# Altium project RGB_Matrix.PrjPcb (part 2 of 2)

## Sheet RGBM-05.SchDoc
size Tabloid; SheetNumber: 5; SheetTotal: 7
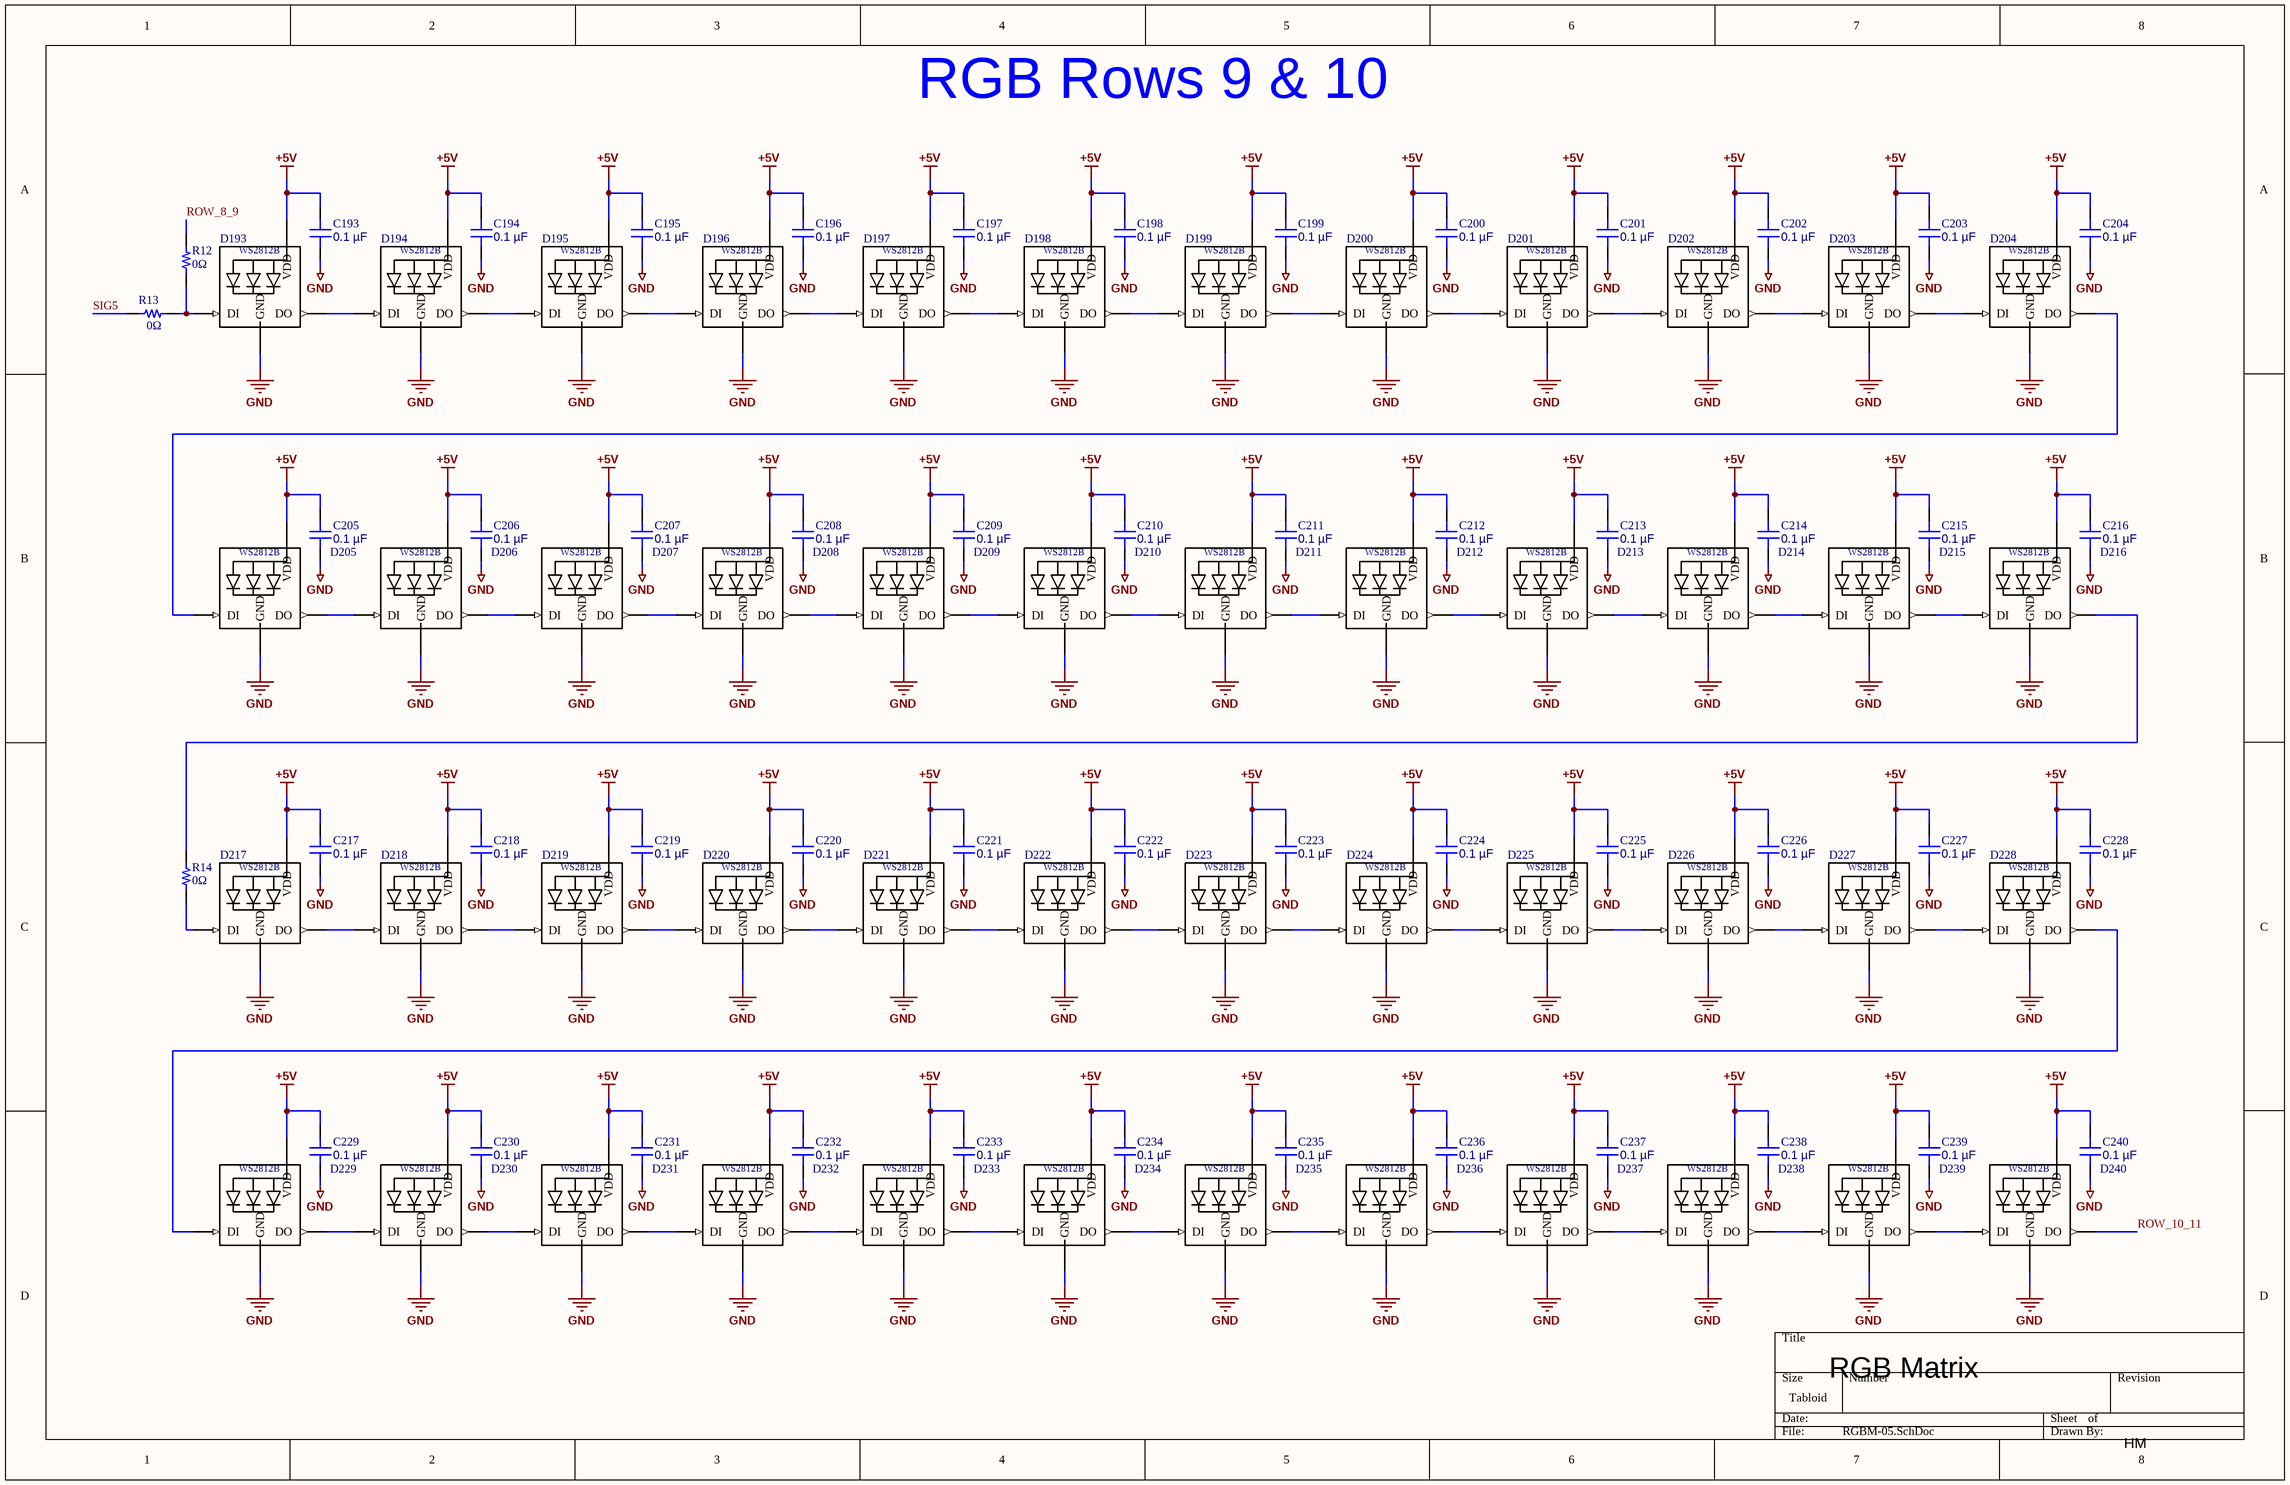
[diagram p4: RGBM-05.SchDoc]

### Parts
C193  0.1 µF  [CAP 0603_1608]
C194  0.1 µF  [CAP 0603_1608]
C195  0.1 µF  [CAP 0603_1608]
C196  0.1 µF  [CAP 0603_1608]
C197  0.1 µF  [CAP 0603_1608]
C198  0.1 µF  [CAP 0603_1608]
C199  0.1 µF  [CAP 0603_1608]
C200  0.1 µF  [CAP 0603_1608]
C201  0.1 µF  [CAP 0603_1608]
C202  0.1 µF  [CAP 0603_1608]
C203  0.1 µF  [CAP 0603_1608]
C204  0.1 µF  [CAP 0603_1608]
C205  0.1 µF  [CAP 0603_1608]
C206  0.1 µF  [CAP 0603_1608]
C207  0.1 µF  [CAP 0603_1608]
C208  0.1 µF  [CAP 0603_1608]
C209  0.1 µF  [CAP 0603_1608]
C210  0.1 µF  [CAP 0603_1608]
C211  0.1 µF  [CAP 0603_1608]
C212  0.1 µF  [CAP 0603_1608]
C213  0.1 µF  [CAP 0603_1608]
C214  0.1 µF  [CAP 0603_1608]
C215  0.1 µF  [CAP 0603_1608]
C216  0.1 µF  [CAP 0603_1608]
C217  0.1 µF  [CAP 0603_1608]
C218  0.1 µF  [CAP 0603_1608]
C219  0.1 µF  [CAP 0603_1608]
C220  0.1 µF  [CAP 0603_1608]
C221  0.1 µF  [CAP 0603_1608]
C222  0.1 µF  [CAP 0603_1608]
C223  0.1 µF  [CAP 0603_1608]
C224  0.1 µF  [CAP 0603_1608]
C225  0.1 µF  [CAP 0603_1608]
C226  0.1 µF  [CAP 0603_1608]
C227  0.1 µF  [CAP 0603_1608]
C228  0.1 µF  [CAP 0603_1608]
C229  0.1 µF  [CAP 0603_1608]
C230  0.1 µF  [CAP 0603_1608]
C231  0.1 µF  [CAP 0603_1608]
C232  0.1 µF  [CAP 0603_1608]
C233  0.1 µF  [CAP 0603_1608]
C234  0.1 µF  [CAP 0603_1608]
C235  0.1 µF  [CAP 0603_1608]
C236  0.1 µF  [CAP 0603_1608]
C237  0.1 µF  [CAP 0603_1608]
C238  0.1 µF  [CAP 0603_1608]
C239  0.1 µF  [CAP 0603_1608]
C240  0.1 µF  [CAP 0603_1608]
D193  WS2812B  [*WS2812B_WS2812B(Primary)]  (value not drawn)
D194  WS2812B  [*WS2812B_WS2812B(Primary)]  (value not drawn)
D195  WS2812B  [*WS2812B_WS2812B(Primary)]  (value not drawn)
D196  WS2812B  [*WS2812B_WS2812B(Primary)]  (value not drawn)
D197  WS2812B  [*WS2812B_WS2812B(Primary)]  (value not drawn)
D198  WS2812B  [*WS2812B_WS2812B(Primary)]  (value not drawn)
D199  WS2812B  [*WS2812B_WS2812B(Primary)]  (value not drawn)
D200  WS2812B  [*WS2812B_WS2812B(Primary)]  (value not drawn)
D201  WS2812B  [*WS2812B_WS2812B(Primary)]  (value not drawn)
D202  WS2812B  [*WS2812B_WS2812B(Primary)]  (value not drawn)
D203  WS2812B  [*WS2812B_WS2812B(Primary)]  (value not drawn)
D204  WS2812B  [*WS2812B_WS2812B(Primary)]  (value not drawn)
D205  WS2812B  [*WS2812B_WS2812B(Primary)]  (value not drawn)
D206  WS2812B  [*WS2812B_WS2812B(Primary)]  (value not drawn)
D207  WS2812B  [*WS2812B_WS2812B(Primary)]  (value not drawn)
D208  WS2812B  [*WS2812B_WS2812B(Primary)]  (value not drawn)
D209  WS2812B  [*WS2812B_WS2812B(Primary)]  (value not drawn)
D210  WS2812B  [*WS2812B_WS2812B(Primary)]  (value not drawn)
D211  WS2812B  [*WS2812B_WS2812B(Primary)]  (value not drawn)
D212  WS2812B  [*WS2812B_WS2812B(Primary)]  (value not drawn)
D213  WS2812B  [*WS2812B_WS2812B(Primary)]  (value not drawn)
D214  WS2812B  [*WS2812B_WS2812B(Primary)]  (value not drawn)
D215  WS2812B  [*WS2812B_WS2812B(Primary)]  (value not drawn)
D216  WS2812B  [*WS2812B_WS2812B(Primary)]  (value not drawn)
D217  WS2812B  [*WS2812B_WS2812B(Primary)]  (value not drawn)
D218  WS2812B  [*WS2812B_WS2812B(Primary)]  (value not drawn)
D219  WS2812B  [*WS2812B_WS2812B(Primary)]  (value not drawn)
D220  WS2812B  [*WS2812B_WS2812B(Primary)]  (value not drawn)
D221  WS2812B  [*WS2812B_WS2812B(Primary)]  (value not drawn)
D222  WS2812B  [*WS2812B_WS2812B(Primary)]  (value not drawn)
D223  WS2812B  [*WS2812B_WS2812B(Primary)]  (value not drawn)
D224  WS2812B  [*WS2812B_WS2812B(Primary)]  (value not drawn)
D225  WS2812B  [*WS2812B_WS2812B(Primary)]  (value not drawn)
D226  WS2812B  [*WS2812B_WS2812B(Primary)]  (value not drawn)
D227  WS2812B  [*WS2812B_WS2812B(Primary)]  (value not drawn)
D228  WS2812B  [*WS2812B_WS2812B(Primary)]  (value not drawn)
D229  WS2812B  [*WS2812B_WS2812B(Primary)]  (value not drawn)
D230  WS2812B  [*WS2812B_WS2812B(Primary)]  (value not drawn)
D231  WS2812B  [*WS2812B_WS2812B(Primary)]  (value not drawn)
D232  WS2812B  [*WS2812B_WS2812B(Primary)]  (value not drawn)
D233  WS2812B  [*WS2812B_WS2812B(Primary)]  (value not drawn)
D234  WS2812B  [*WS2812B_WS2812B(Primary)]  (value not drawn)
D235  WS2812B  [*WS2812B_WS2812B(Primary)]  (value not drawn)
D236  WS2812B  [*WS2812B_WS2812B(Primary)]  (value not drawn)
D237  WS2812B  [*WS2812B_WS2812B(Primary)]  (value not drawn)
D238  WS2812B  [*WS2812B_WS2812B(Primary)]  (value not drawn)
D239  WS2812B  [*WS2812B_WS2812B(Primary)]  (value not drawn)
D240  WS2812B  [*WS2812B_WS2812B(Primary)]  (value not drawn)
R12  0Ω  [RES 0603_1608]
R13  0Ω  [RES 0603_1608]
R14  0Ω  [RES 0603_1608]

### Nets
+5V: C193.2 C194.2 C195.2 C196.2 C197.2 C198.2 C199.2 C200.2 C201.2 C202.2 C203.2 C204.2 C205.2 C206.2 C207.2 C208.2 C209.2 C210.2 C211.2 C212.2 C213.2 C214.2 C215.2 C216.2 C217.2 C218.2 C219.2 C220.2 C221.2 C222.2 C223.2 C224.2 C225.2 C226.2 C227.2 C228.2 C229.2 C230.2 C231.2 C232.2 C233.2 C234.2 C235.2 C236.2 C237.2 C238.2 C239.2 C240.2 D193.1-VDD(VDD) D194.1-VDD(VDD) D195.1-VDD(VDD) D196.1-VDD(VDD) D197.1-VDD(VDD) D198.1-VDD(VDD) D199.1-VDD(VDD) D200.1-VDD(VDD) D201.1-VDD(VDD) D202.1-VDD(VDD) D203.1-VDD(VDD) D204.1-VDD(VDD) D205.1-VDD(VDD) D206.1-VDD(VDD) D207.1-VDD(VDD) D208.1-VDD(VDD) D209.1-VDD(VDD) D210.1-VDD(VDD) D211.1-VDD(VDD) D212.1-VDD(VDD) D213.1-VDD(VDD) D214.1-VDD(VDD) D215.1-VDD(VDD) D216.1-VDD(VDD) D217.1-VDD(VDD) D218.1-VDD(VDD) D219.1-VDD(VDD) D220.1-VDD(VDD) D221.1-VDD(VDD) D222.1-VDD(VDD) D223.1-VDD(VDD) D224.1-VDD(VDD) D225.1-VDD(VDD) D226.1-VDD(VDD) D227.1-VDD(VDD) D228.1-VDD(VDD) D229.1-VDD(VDD) D230.1-VDD(VDD) D231.1-VDD(VDD) D232.1-VDD(VDD) D233.1-VDD(VDD) D234.1-VDD(VDD) D235.1-VDD(VDD) D236.1-VDD(VDD) D237.1-VDD(VDD) D238.1-VDD(VDD) D239.1-VDD(VDD) D240.1-VDD(VDD)
GND: C193.1 C194.1 C195.1 C196.1 C197.1 C198.1 C199.1 C200.1 C201.1 C202.1 C203.1 C204.1 C205.1 C206.1 C207.1 C208.1 C209.1 C210.1 C211.1 C212.1 C213.1 C214.1 C215.1 C216.1 C217.1 C218.1 C219.1 C220.1 C221.1 C222.1 C223.1 C224.1 C225.1 C226.1 C227.1 C228.1 C229.1 C230.1 C231.1 C232.1 C233.1 C234.1 C235.1 C236.1 C237.1 C238.1 C239.1 C240.1 D193.3-GND(GND) D194.3-GND(GND) D195.3-GND(GND) D196.3-GND(GND) D197.3-GND(GND) D198.3-GND(GND) D199.3-GND(GND) D200.3-GND(GND) D201.3-GND(GND) D202.3-GND(GND) D203.3-GND(GND) D204.3-GND(GND) D205.3-GND(GND) D206.3-GND(GND) D207.3-GND(GND) D208.3-GND(GND) D209.3-GND(GND) D210.3-GND(GND) D211.3-GND(GND) D212.3-GND(GND) D213.3-GND(GND) D214.3-GND(GND) D215.3-GND(GND) D216.3-GND(GND) D217.3-GND(GND) D218.3-GND(GND) D219.3-GND(GND) D220.3-GND(GND) D221.3-GND(GND) D222.3-GND(GND) D223.3-GND(GND) D224.3-GND(GND) D225.3-GND(GND) D226.3-GND(GND) D227.3-GND(GND) D228.3-GND(GND) D229.3-GND(GND) D230.3-GND(GND) D231.3-GND(GND) D232.3-GND(GND) D233.3-GND(GND) D234.3-GND(GND) D235.3-GND(GND) D236.3-GND(GND) D237.3-GND(GND) D238.3-GND(GND) D239.3-GND(GND) D240.3-GND(GND)
ROW_8_9: R12.2
ROW_10_11: D240.2-DOUT(DO)
SIG5: R13.1
NetD193_2-DOUT: D193.2-DOUT(DO) D194.4-DIN(DI)
NetD193_4-DIN: D193.4-DIN(DI) R12.1 R13.2
NetD194_2-DOUT: D194.2-DOUT(DO) D195.4-DIN(DI)
NetD195_2-DOUT: D195.2-DOUT(DO) D196.4-DIN(DI)
NetD196_2-DOUT: D196.2-DOUT(DO) D197.4-DIN(DI)
NetD197_2-DOUT: D197.2-DOUT(DO) D198.4-DIN(DI)
NetD198_2-DOUT: D198.2-DOUT(DO) D199.4-DIN(DI)
NetD199_2-DOUT: D199.2-DOUT(DO) D200.4-DIN(DI)
NetD200_2-DOUT: D200.2-DOUT(DO) D201.4-DIN(DI)
NetD201_2-DOUT: D201.2-DOUT(DO) D202.4-DIN(DI)
NetD202_2-DOUT: D202.2-DOUT(DO) D203.4-DIN(DI)
NetD203_2-DOUT: D203.2-DOUT(DO) D204.4-DIN(DI)
NetD204_2-DOUT: D204.2-DOUT(DO) D205.4-DIN(DI)
NetD205_2-DOUT: D205.2-DOUT(DO) D206.4-DIN(DI)
NetD206_2-DOUT: D206.2-DOUT(DO) D207.4-DIN(DI)
NetD207_2-DOUT: D207.2-DOUT(DO) D208.4-DIN(DI)
NetD208_2-DOUT: D208.2-DOUT(DO) D209.4-DIN(DI)
NetD209_2-DOUT: D209.2-DOUT(DO) D210.4-DIN(DI)
NetD210_2-DOUT: D210.2-DOUT(DO) D211.4-DIN(DI)
NetD211_2-DOUT: D211.2-DOUT(DO) D212.4-DIN(DI)
NetD212_2-DOUT: D212.2-DOUT(DO) D213.4-DIN(DI)
NetD213_2-DOUT: D213.2-DOUT(DO) D214.4-DIN(DI)
NetD214_2-DOUT: D214.2-DOUT(DO) D215.4-DIN(DI)
NetD215_2-DOUT: D215.2-DOUT(DO) D216.4-DIN(DI)
NetD216_2-DOUT: D216.2-DOUT(DO) R14.2
NetD217_2-DOUT: D217.2-DOUT(DO) D218.4-DIN(DI)
NetD217_4-DIN: D217.4-DIN(DI) R14.1
NetD218_2-DOUT: D218.2-DOUT(DO) D219.4-DIN(DI)
NetD219_2-DOUT: D219.2-DOUT(DO) D220.4-DIN(DI)
NetD220_2-DOUT: D220.2-DOUT(DO) D221.4-DIN(DI)
NetD221_2-DOUT: D221.2-DOUT(DO) D222.4-DIN(DI)
NetD222_2-DOUT: D222.2-DOUT(DO) D223.4-DIN(DI)
NetD223_2-DOUT: D223.2-DOUT(DO) D224.4-DIN(DI)
NetD224_2-DOUT: D224.2-DOUT(DO) D225.4-DIN(DI)
NetD225_2-DOUT: D225.2-DOUT(DO) D226.4-DIN(DI)
NetD226_2-DOUT: D226.2-DOUT(DO) D227.4-DIN(DI)
NetD227_2-DOUT: D227.2-DOUT(DO) D228.4-DIN(DI)
NetD228_2-DOUT: D228.2-DOUT(DO) D229.4-DIN(DI)
NetD229_2-DOUT: D229.2-DOUT(DO) D230.4-DIN(DI)
NetD230_2-DOUT: D230.2-DOUT(DO) D231.4-DIN(DI)
NetD231_2-DOUT: D231.2-DOUT(DO) D232.4-DIN(DI)
NetD232_2-DOUT: D232.2-DOUT(DO) D233.4-DIN(DI)
NetD233_2-DOUT: D233.2-DOUT(DO) D234.4-DIN(DI)
NetD234_2-DOUT: D234.2-DOUT(DO) D235.4-DIN(DI)
NetD235_2-DOUT: D235.2-DOUT(DO) D236.4-DIN(DI)
NetD236_2-DOUT: D236.2-DOUT(DO) D237.4-DIN(DI)
NetD237_2-DOUT: D237.2-DOUT(DO) D238.4-DIN(DI)
NetD238_2-DOUT: D238.2-DOUT(DO) D239.4-DIN(DI)
NetD239_2-DOUT: D239.2-DOUT(DO) D240.4-DIN(DI)

### Notes on the sheet
- RGB Rows 9 & 10
- RGB Matrix
- HM

### Library data of the parts
C193-C240 = C0603C104K5RAC7411: as C1 on sheet RGBM-01; Part Number: C0603C104K5RAC7411; Capacitance: 0.1 µF; Applications: Bypass, Decoupling; componentlink1description: Datasheet; componentlink1url: https://api.kemet.com/component-edge/download/datasheet/C0603C104K5RAC7411.pdf; componentlink2description: DigiKey Link; componentlink2url: https://www.digikey.com/en/products/detail/kemet/C0603C104K5RAC7411/3317013; Device Package: 0603 (1608 Metric); lastupdated: 2026-04-06 7:23:52 PM; Lifecycle Status: Active; Minimum Order: 1; Mounting Type: Surface Mount, MLCC; Operating Temperature: -55°C ~ 125°C; Package / Case: 0603 (1608 Metric); packaging: TapeAndReel; partid: 2233; Part Status: Active; price: 0.01; series: SMD Comm X7R; Size / Dimension: 0.063" L x 0.031" W (1.60mm x 0.80mm); Supplier 1: DigiKey; Supplier Part Number 1: 399-C0603C104K5RAC7411CT-ND; Temperature Coefficient: X7R; Thickness (Max): 0.035" (0.90mm); value: 0.1 µF; Voltage - Rated: 50V
D193-D240 = WS2812B: as D1 on sheet RGBM-01; SnapEDA_Link: https://www.snapeda.com/parts/WS2812B/Worldsemi/view-part/?ref=snap; Package: None; MP: WS2812B; Check_prices: https://www.snapeda.com/parts/WS2812B/Worldsemi/view-part/?ref=eda; Value: *
R12-R14 = YJP1608-R001: as R1 on sheet RGBM-01; Part Number: YJP1608-R001; ComponentLink1Description: Datasheet; ComponentLink1URL: http://www.susumu.co.jp/common/pdf/n_catalog_partition10_en.pdf; ComponentLink2Description: DigiKey Link; ComponentLink2URL: https://www.digikey.com/en/products/detail/susumu/YJP1608-R001/2815047; Composition: Thin Film; Device Package: 0603 (1608 Metric); Height - Seated (Max): 0.016" (0.40mm); LastUpdated: 2024-02-09 8:42:50 PM; Lifecycle Status: Active; Minimum Order: 1; Number of Terminations: 2; Operating Temperature: -40°C ~ 125°C; Package / Case: 0603 (1608 Metric); Packaging: TapeAndReel; PartId: 16802; Part Status: Active; Price: 0.08; Resistance: 0 Ohms; Series: YJP; Size / Dimension: 0.063" L x 0.031" W (1.60mm x 0.80mm); Supplier 1: DigiKey; Supplier Part Number 1: 408-1515-1-ND; Supplier Device Package: 0603; Tolerance: Jumper

## Sheet RGBM-06.SchDoc
size Tabloid; SheetNumber: 6; SheetTotal: 7
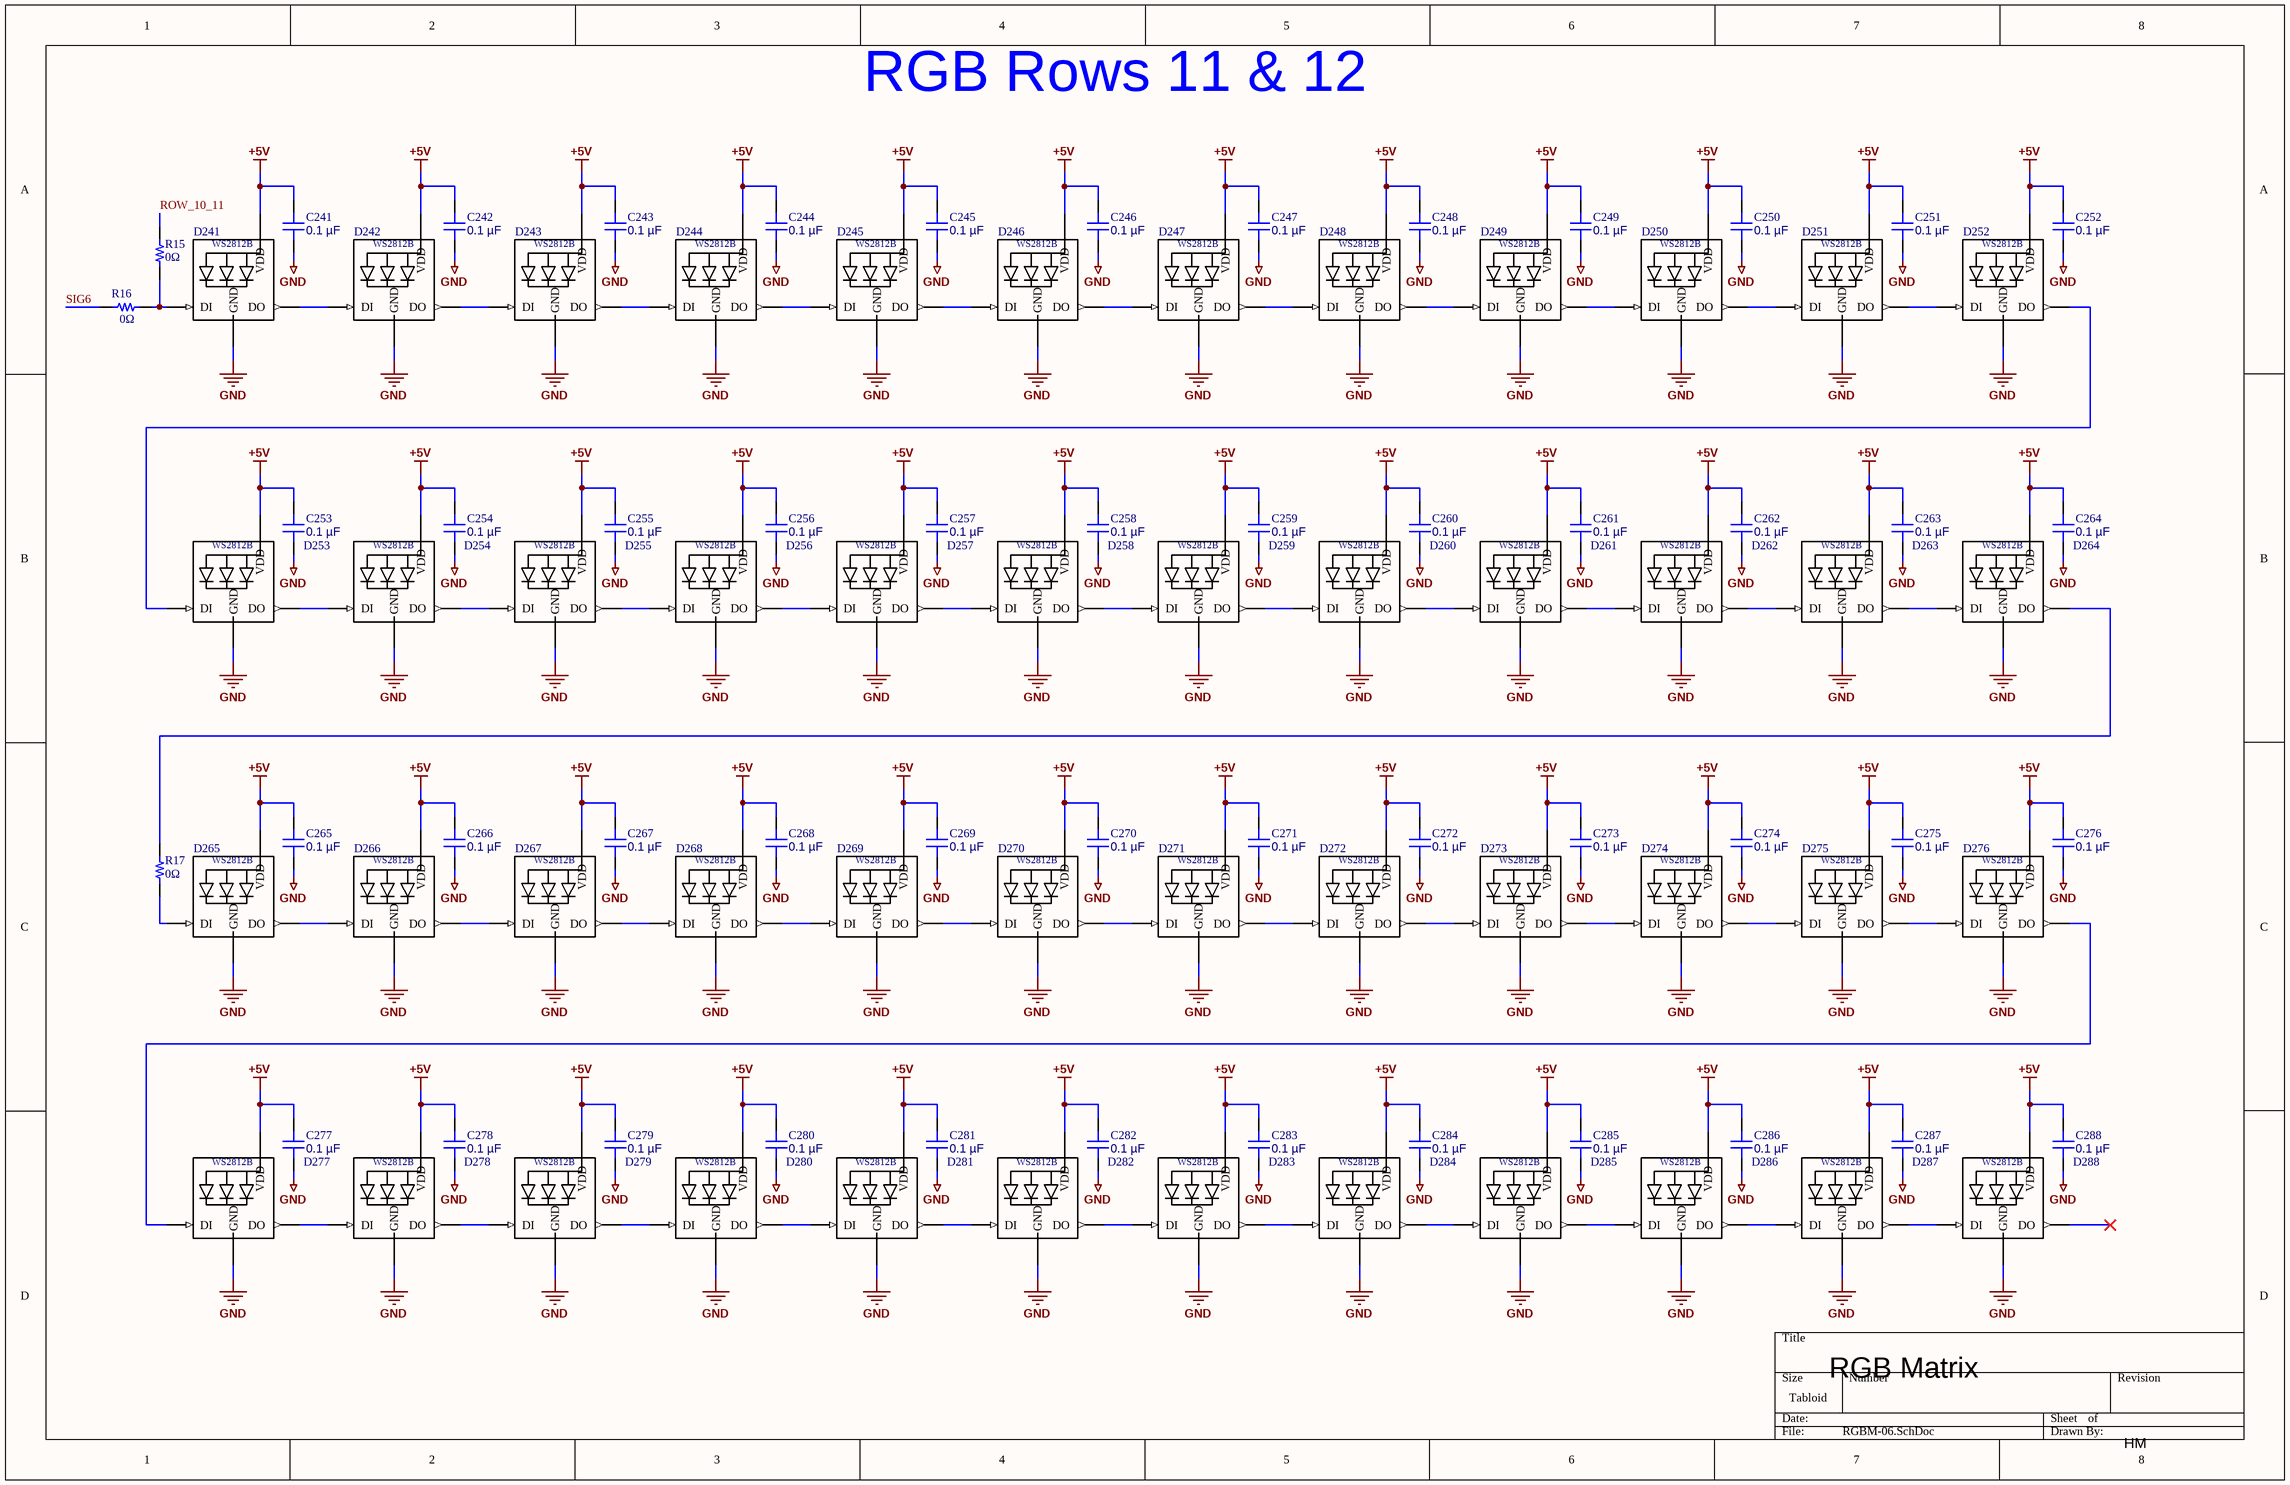
[diagram p5: RGBM-06.SchDoc]

### Parts
C241  0.1 µF  [CAP 0603_1608]
C242  0.1 µF  [CAP 0603_1608]
C243  0.1 µF  [CAP 0603_1608]
C244  0.1 µF  [CAP 0603_1608]
C245  0.1 µF  [CAP 0603_1608]
C246  0.1 µF  [CAP 0603_1608]
C247  0.1 µF  [CAP 0603_1608]
C248  0.1 µF  [CAP 0603_1608]
C249  0.1 µF  [CAP 0603_1608]
C250  0.1 µF  [CAP 0603_1608]
C251  0.1 µF  [CAP 0603_1608]
C252  0.1 µF  [CAP 0603_1608]
C253  0.1 µF  [CAP 0603_1608]
C254  0.1 µF  [CAP 0603_1608]
C255  0.1 µF  [CAP 0603_1608]
C256  0.1 µF  [CAP 0603_1608]
C257  0.1 µF  [CAP 0603_1608]
C258  0.1 µF  [CAP 0603_1608]
C259  0.1 µF  [CAP 0603_1608]
C260  0.1 µF  [CAP 0603_1608]
C261  0.1 µF  [CAP 0603_1608]
C262  0.1 µF  [CAP 0603_1608]
C263  0.1 µF  [CAP 0603_1608]
C264  0.1 µF  [CAP 0603_1608]
C265  0.1 µF  [CAP 0603_1608]
C266  0.1 µF  [CAP 0603_1608]
C267  0.1 µF  [CAP 0603_1608]
C268  0.1 µF  [CAP 0603_1608]
C269  0.1 µF  [CAP 0603_1608]
C270  0.1 µF  [CAP 0603_1608]
C271  0.1 µF  [CAP 0603_1608]
C272  0.1 µF  [CAP 0603_1608]
C273  0.1 µF  [CAP 0603_1608]
C274  0.1 µF  [CAP 0603_1608]
C275  0.1 µF  [CAP 0603_1608]
C276  0.1 µF  [CAP 0603_1608]
C277  0.1 µF  [CAP 0603_1608]
C278  0.1 µF  [CAP 0603_1608]
C279  0.1 µF  [CAP 0603_1608]
C280  0.1 µF  [CAP 0603_1608]
C281  0.1 µF  [CAP 0603_1608]
C282  0.1 µF  [CAP 0603_1608]
C283  0.1 µF  [CAP 0603_1608]
C284  0.1 µF  [CAP 0603_1608]
C285  0.1 µF  [CAP 0603_1608]
C286  0.1 µF  [CAP 0603_1608]
C287  0.1 µF  [CAP 0603_1608]
C288  0.1 µF  [CAP 0603_1608]
D241  WS2812B  [*WS2812B_WS2812B(Primary)]  (value not drawn)
D242  WS2812B  [*WS2812B_WS2812B(Primary)]  (value not drawn)
D243  WS2812B  [*WS2812B_WS2812B(Primary)]  (value not drawn)
D244  WS2812B  [*WS2812B_WS2812B(Primary)]  (value not drawn)
D245  WS2812B  [*WS2812B_WS2812B(Primary)]  (value not drawn)
D246  WS2812B  [*WS2812B_WS2812B(Primary)]  (value not drawn)
D247  WS2812B  [*WS2812B_WS2812B(Primary)]  (value not drawn)
D248  WS2812B  [*WS2812B_WS2812B(Primary)]  (value not drawn)
D249  WS2812B  [*WS2812B_WS2812B(Primary)]  (value not drawn)
D250  WS2812B  [*WS2812B_WS2812B(Primary)]  (value not drawn)
D251  WS2812B  [*WS2812B_WS2812B(Primary)]  (value not drawn)
D252  WS2812B  [*WS2812B_WS2812B(Primary)]  (value not drawn)
D253  WS2812B  [*WS2812B_WS2812B(Primary)]  (value not drawn)
D254  WS2812B  [*WS2812B_WS2812B(Primary)]  (value not drawn)
D255  WS2812B  [*WS2812B_WS2812B(Primary)]  (value not drawn)
D256  WS2812B  [*WS2812B_WS2812B(Primary)]  (value not drawn)
D257  WS2812B  [*WS2812B_WS2812B(Primary)]  (value not drawn)
D258  WS2812B  [*WS2812B_WS2812B(Primary)]  (value not drawn)
D259  WS2812B  [*WS2812B_WS2812B(Primary)]  (value not drawn)
D260  WS2812B  [*WS2812B_WS2812B(Primary)]  (value not drawn)
D261  WS2812B  [*WS2812B_WS2812B(Primary)]  (value not drawn)
D262  WS2812B  [*WS2812B_WS2812B(Primary)]  (value not drawn)
D263  WS2812B  [*WS2812B_WS2812B(Primary)]  (value not drawn)
D264  WS2812B  [*WS2812B_WS2812B(Primary)]  (value not drawn)
D265  WS2812B  [*WS2812B_WS2812B(Primary)]  (value not drawn)
D266  WS2812B  [*WS2812B_WS2812B(Primary)]  (value not drawn)
D267  WS2812B  [*WS2812B_WS2812B(Primary)]  (value not drawn)
D268  WS2812B  [*WS2812B_WS2812B(Primary)]  (value not drawn)
D269  WS2812B  [*WS2812B_WS2812B(Primary)]  (value not drawn)
D270  WS2812B  [*WS2812B_WS2812B(Primary)]  (value not drawn)
D271  WS2812B  [*WS2812B_WS2812B(Primary)]  (value not drawn)
D272  WS2812B  [*WS2812B_WS2812B(Primary)]  (value not drawn)
D273  WS2812B  [*WS2812B_WS2812B(Primary)]  (value not drawn)
D274  WS2812B  [*WS2812B_WS2812B(Primary)]  (value not drawn)
D275  WS2812B  [*WS2812B_WS2812B(Primary)]  (value not drawn)
D276  WS2812B  [*WS2812B_WS2812B(Primary)]  (value not drawn)
D277  WS2812B  [*WS2812B_WS2812B(Primary)]  (value not drawn)
D278  WS2812B  [*WS2812B_WS2812B(Primary)]  (value not drawn)
D279  WS2812B  [*WS2812B_WS2812B(Primary)]  (value not drawn)
D280  WS2812B  [*WS2812B_WS2812B(Primary)]  (value not drawn)
D281  WS2812B  [*WS2812B_WS2812B(Primary)]  (value not drawn)
D282  WS2812B  [*WS2812B_WS2812B(Primary)]  (value not drawn)
D283  WS2812B  [*WS2812B_WS2812B(Primary)]  (value not drawn)
D284  WS2812B  [*WS2812B_WS2812B(Primary)]  (value not drawn)
D285  WS2812B  [*WS2812B_WS2812B(Primary)]  (value not drawn)
D286  WS2812B  [*WS2812B_WS2812B(Primary)]  (value not drawn)
D287  WS2812B  [*WS2812B_WS2812B(Primary)]  (value not drawn)
D288  WS2812B  [*WS2812B_WS2812B(Primary)]  (value not drawn)
R15  0Ω  [RES 0603_1608]
R16  0Ω  [RES 0603_1608]
R17  0Ω  [RES 0603_1608]

### Nets
+5V: C241.2 C242.2 C243.2 C244.2 C245.2 C246.2 C247.2 C248.2 C249.2 C250.2 C251.2 C252.2 C253.2 C254.2 C255.2 C256.2 C257.2 C258.2 C259.2 C260.2 C261.2 C262.2 C263.2 C264.2 C265.2 C266.2 C267.2 C268.2 C269.2 C270.2 C271.2 C272.2 C273.2 C274.2 C275.2 C276.2 C277.2 C278.2 C279.2 C280.2 C281.2 C282.2 C283.2 C284.2 C285.2 C286.2 C287.2 C288.2 D241.1-VDD(VDD) D242.1-VDD(VDD) D243.1-VDD(VDD) D244.1-VDD(VDD) D245.1-VDD(VDD) D246.1-VDD(VDD) D247.1-VDD(VDD) D248.1-VDD(VDD) D249.1-VDD(VDD) D250.1-VDD(VDD) D251.1-VDD(VDD) D252.1-VDD(VDD) D253.1-VDD(VDD) D254.1-VDD(VDD) D255.1-VDD(VDD) D256.1-VDD(VDD) D257.1-VDD(VDD) D258.1-VDD(VDD) D259.1-VDD(VDD) D260.1-VDD(VDD) D261.1-VDD(VDD) D262.1-VDD(VDD) D263.1-VDD(VDD) D264.1-VDD(VDD) D265.1-VDD(VDD) D266.1-VDD(VDD) D267.1-VDD(VDD) D268.1-VDD(VDD) D269.1-VDD(VDD) D270.1-VDD(VDD) D271.1-VDD(VDD) D272.1-VDD(VDD) D273.1-VDD(VDD) D274.1-VDD(VDD) D275.1-VDD(VDD) D276.1-VDD(VDD) D277.1-VDD(VDD) D278.1-VDD(VDD) D279.1-VDD(VDD) D280.1-VDD(VDD) D281.1-VDD(VDD) D282.1-VDD(VDD) D283.1-VDD(VDD) D284.1-VDD(VDD) D285.1-VDD(VDD) D286.1-VDD(VDD) D287.1-VDD(VDD) D288.1-VDD(VDD)
GND: C241.1 C242.1 C243.1 C244.1 C245.1 C246.1 C247.1 C248.1 C249.1 C250.1 C251.1 C252.1 C253.1 C254.1 C255.1 C256.1 C257.1 C258.1 C259.1 C260.1 C261.1 C262.1 C263.1 C264.1 C265.1 C266.1 C267.1 C268.1 C269.1 C270.1 C271.1 C272.1 C273.1 C274.1 C275.1 C276.1 C277.1 C278.1 C279.1 C280.1 C281.1 C282.1 C283.1 C284.1 C285.1 C286.1 C287.1 C288.1 D241.3-GND(GND) D242.3-GND(GND) D243.3-GND(GND) D244.3-GND(GND) D245.3-GND(GND) D246.3-GND(GND) D247.3-GND(GND) D248.3-GND(GND) D249.3-GND(GND) D250.3-GND(GND) D251.3-GND(GND) D252.3-GND(GND) D253.3-GND(GND) D254.3-GND(GND) D255.3-GND(GND) D256.3-GND(GND) D257.3-GND(GND) D258.3-GND(GND) D259.3-GND(GND) D260.3-GND(GND) D261.3-GND(GND) D262.3-GND(GND) D263.3-GND(GND) D264.3-GND(GND) D265.3-GND(GND) D266.3-GND(GND) D267.3-GND(GND) D268.3-GND(GND) D269.3-GND(GND) D270.3-GND(GND) D271.3-GND(GND) D272.3-GND(GND) D273.3-GND(GND) D274.3-GND(GND) D275.3-GND(GND) D276.3-GND(GND) D277.3-GND(GND) D278.3-GND(GND) D279.3-GND(GND) D280.3-GND(GND) D281.3-GND(GND) D282.3-GND(GND) D283.3-GND(GND) D284.3-GND(GND) D285.3-GND(GND) D286.3-GND(GND) D287.3-GND(GND) D288.3-GND(GND)
ROW_10_11: R15.2
SIG6: R16.1
NetD241_2-DOUT: D241.2-DOUT(DO) D242.4-DIN(DI)
NetD241_4-DIN: D241.4-DIN(DI) R15.1 R16.2
NetD242_2-DOUT: D242.2-DOUT(DO) D243.4-DIN(DI)
NetD243_2-DOUT: D243.2-DOUT(DO) D244.4-DIN(DI)
NetD244_2-DOUT: D244.2-DOUT(DO) D245.4-DIN(DI)
NetD245_2-DOUT: D245.2-DOUT(DO) D246.4-DIN(DI)
NetD246_2-DOUT: D246.2-DOUT(DO) D247.4-DIN(DI)
NetD247_2-DOUT: D247.2-DOUT(DO) D248.4-DIN(DI)
NetD248_2-DOUT: D248.2-DOUT(DO) D249.4-DIN(DI)
NetD249_2-DOUT: D249.2-DOUT(DO) D250.4-DIN(DI)
NetD250_2-DOUT: D250.2-DOUT(DO) D251.4-DIN(DI)
NetD251_2-DOUT: D251.2-DOUT(DO) D252.4-DIN(DI)
NetD252_2-DOUT: D252.2-DOUT(DO) D253.4-DIN(DI)
NetD253_2-DOUT: D253.2-DOUT(DO) D254.4-DIN(DI)
NetD254_2-DOUT: D254.2-DOUT(DO) D255.4-DIN(DI)
NetD255_2-DOUT: D255.2-DOUT(DO) D256.4-DIN(DI)
NetD256_2-DOUT: D256.2-DOUT(DO) D257.4-DIN(DI)
NetD257_2-DOUT: D257.2-DOUT(DO) D258.4-DIN(DI)
NetD258_2-DOUT: D258.2-DOUT(DO) D259.4-DIN(DI)
NetD259_2-DOUT: D259.2-DOUT(DO) D260.4-DIN(DI)
NetD260_2-DOUT: D260.2-DOUT(DO) D261.4-DIN(DI)
NetD261_2-DOUT: D261.2-DOUT(DO) D262.4-DIN(DI)
NetD262_2-DOUT: D262.2-DOUT(DO) D263.4-DIN(DI)
NetD263_2-DOUT: D263.2-DOUT(DO) D264.4-DIN(DI)
NetD264_2-DOUT: D264.2-DOUT(DO) R17.2
NetD265_2-DOUT: D265.2-DOUT(DO) D266.4-DIN(DI)
NetD265_4-DIN: D265.4-DIN(DI) R17.1
NetD266_2-DOUT: D266.2-DOUT(DO) D267.4-DIN(DI)
NetD267_2-DOUT: D267.2-DOUT(DO) D268.4-DIN(DI)
NetD268_2-DOUT: D268.2-DOUT(DO) D269.4-DIN(DI)
NetD269_2-DOUT: D269.2-DOUT(DO) D270.4-DIN(DI)
NetD270_2-DOUT: D270.2-DOUT(DO) D271.4-DIN(DI)
NetD271_2-DOUT: D271.2-DOUT(DO) D272.4-DIN(DI)
NetD272_2-DOUT: D272.2-DOUT(DO) D273.4-DIN(DI)
NetD273_2-DOUT: D273.2-DOUT(DO) D274.4-DIN(DI)
NetD274_2-DOUT: D274.2-DOUT(DO) D275.4-DIN(DI)
NetD275_2-DOUT: D275.2-DOUT(DO) D276.4-DIN(DI)
NetD276_2-DOUT: D276.2-DOUT(DO) D277.4-DIN(DI)
NetD277_2-DOUT: D277.2-DOUT(DO) D278.4-DIN(DI)
NetD278_2-DOUT: D278.2-DOUT(DO) D279.4-DIN(DI)
NetD279_2-DOUT: D279.2-DOUT(DO) D280.4-DIN(DI)
NetD280_2-DOUT: D280.2-DOUT(DO) D281.4-DIN(DI)
NetD281_2-DOUT: D281.2-DOUT(DO) D282.4-DIN(DI)
NetD282_2-DOUT: D282.2-DOUT(DO) D283.4-DIN(DI)
NetD283_2-DOUT: D283.2-DOUT(DO) D284.4-DIN(DI)
NetD284_2-DOUT: D284.2-DOUT(DO) D285.4-DIN(DI)
NetD285_2-DOUT: D285.2-DOUT(DO) D286.4-DIN(DI)
NetD286_2-DOUT: D286.2-DOUT(DO) D287.4-DIN(DI)
NetD287_2-DOUT: D287.2-DOUT(DO) D288.4-DIN(DI)

Not connected (* = marked no-connect by the designer): D288 2-DOUT(DO)*

### Notes on the sheet
- RGB Rows 11 & 12
- RGB Matrix
- HM

### Library data of the parts
C241-C288 = C0603C104K5RAC7411: CAP CER 0.1UF 50V X7R 0603; manufacturer: KEMET; Tolerance: ±10%; Part Number: C0603C104K5RAC7411; Capacitance: 0.1 µF; Applications: Bypass, Decoupling; componentlink1description: Datasheet; componentlink1url: https://api.kemet.com/component-edge/download/datasheet/C0603C104K5RAC7411.pdf; componentlink2description: DigiKey Link; componentlink2url: https://www.digikey.com/en/products/detail/kemet/C0603C104K5RAC7411/3317013; Device Package: 0603 (1608 Metric); lastupdated: 2026-04-06 7:23:52 PM; Lifecycle Status: Active; Minimum Order: 1; Mounting Type: Surface Mount, MLCC; Operating Temperature: -55°C ~ 125°C; Package / Case: 0603 (1608 Metric); packaging: TapeAndReel; partid: 2233; Part Status: Active; price: 0.01; series: SMD Comm X7R; Size / Dimension: 0.063" L x 0.031" W (1.60mm x 0.80mm); Supplier 1: DigiKey; Supplier Part Number 1: 399-C0603C104K5RAC7411CT-ND; Temperature Coefficient: X7R; Thickness (Max): 0.035" (0.90mm); value: 0.1 µF; Voltage - Rated: 50V
D241-D288 = WS2812B: Intelligent control LED integrated light source; MF: Worldsemi; SnapEDA_Link: https://www.snapeda.com/parts/WS2812B/Worldsemi/view-part/?ref=snap; Package: None; MP: WS2812B; Check_prices: https://www.snapeda.com/parts/WS2812B/Worldsemi/view-part/?ref=eda; Value: *
R15-R17 = YJP1608-R001: RES SMD 0 OHM JUMPER 0603; Manufacturer: Susumu; Value: 0 Ohms; Part Number: YJP1608-R001; ComponentLink1Description: Datasheet; ComponentLink1URL: http://www.susumu.co.jp/common/pdf/n_catalog_partition10_en.pdf; ComponentLink2Description: DigiKey Link; ComponentLink2URL: https://www.digikey.com/en/products/detail/susumu/YJP1608-R001/2815047; Composition: Thin Film; Device Package: 0603 (1608 Metric); Height - Seated (Max): 0.016" (0.40mm); LastUpdated: 2024-02-09 8:42:50 PM; Lifecycle Status: Active; Minimum Order: 1; Number of Terminations: 2; Operating Temperature: -40°C ~ 125°C; Package / Case: 0603 (1608 Metric); Packaging: TapeAndReel; PartId: 16802; Part Status: Active; Price: 0.08; Resistance: 0 Ohms; Series: YJP; Size / Dimension: 0.063" L x 0.031" W (1.60mm x 0.80mm); Supplier 1: DigiKey; Supplier Part Number 1: 408-1515-1-ND; Supplier Device Package: 0603; Tolerance: Jumper

## Sheet RGBM-07.SchDoc
size Tabloid; SheetNumber: 7; SheetTotal: 7
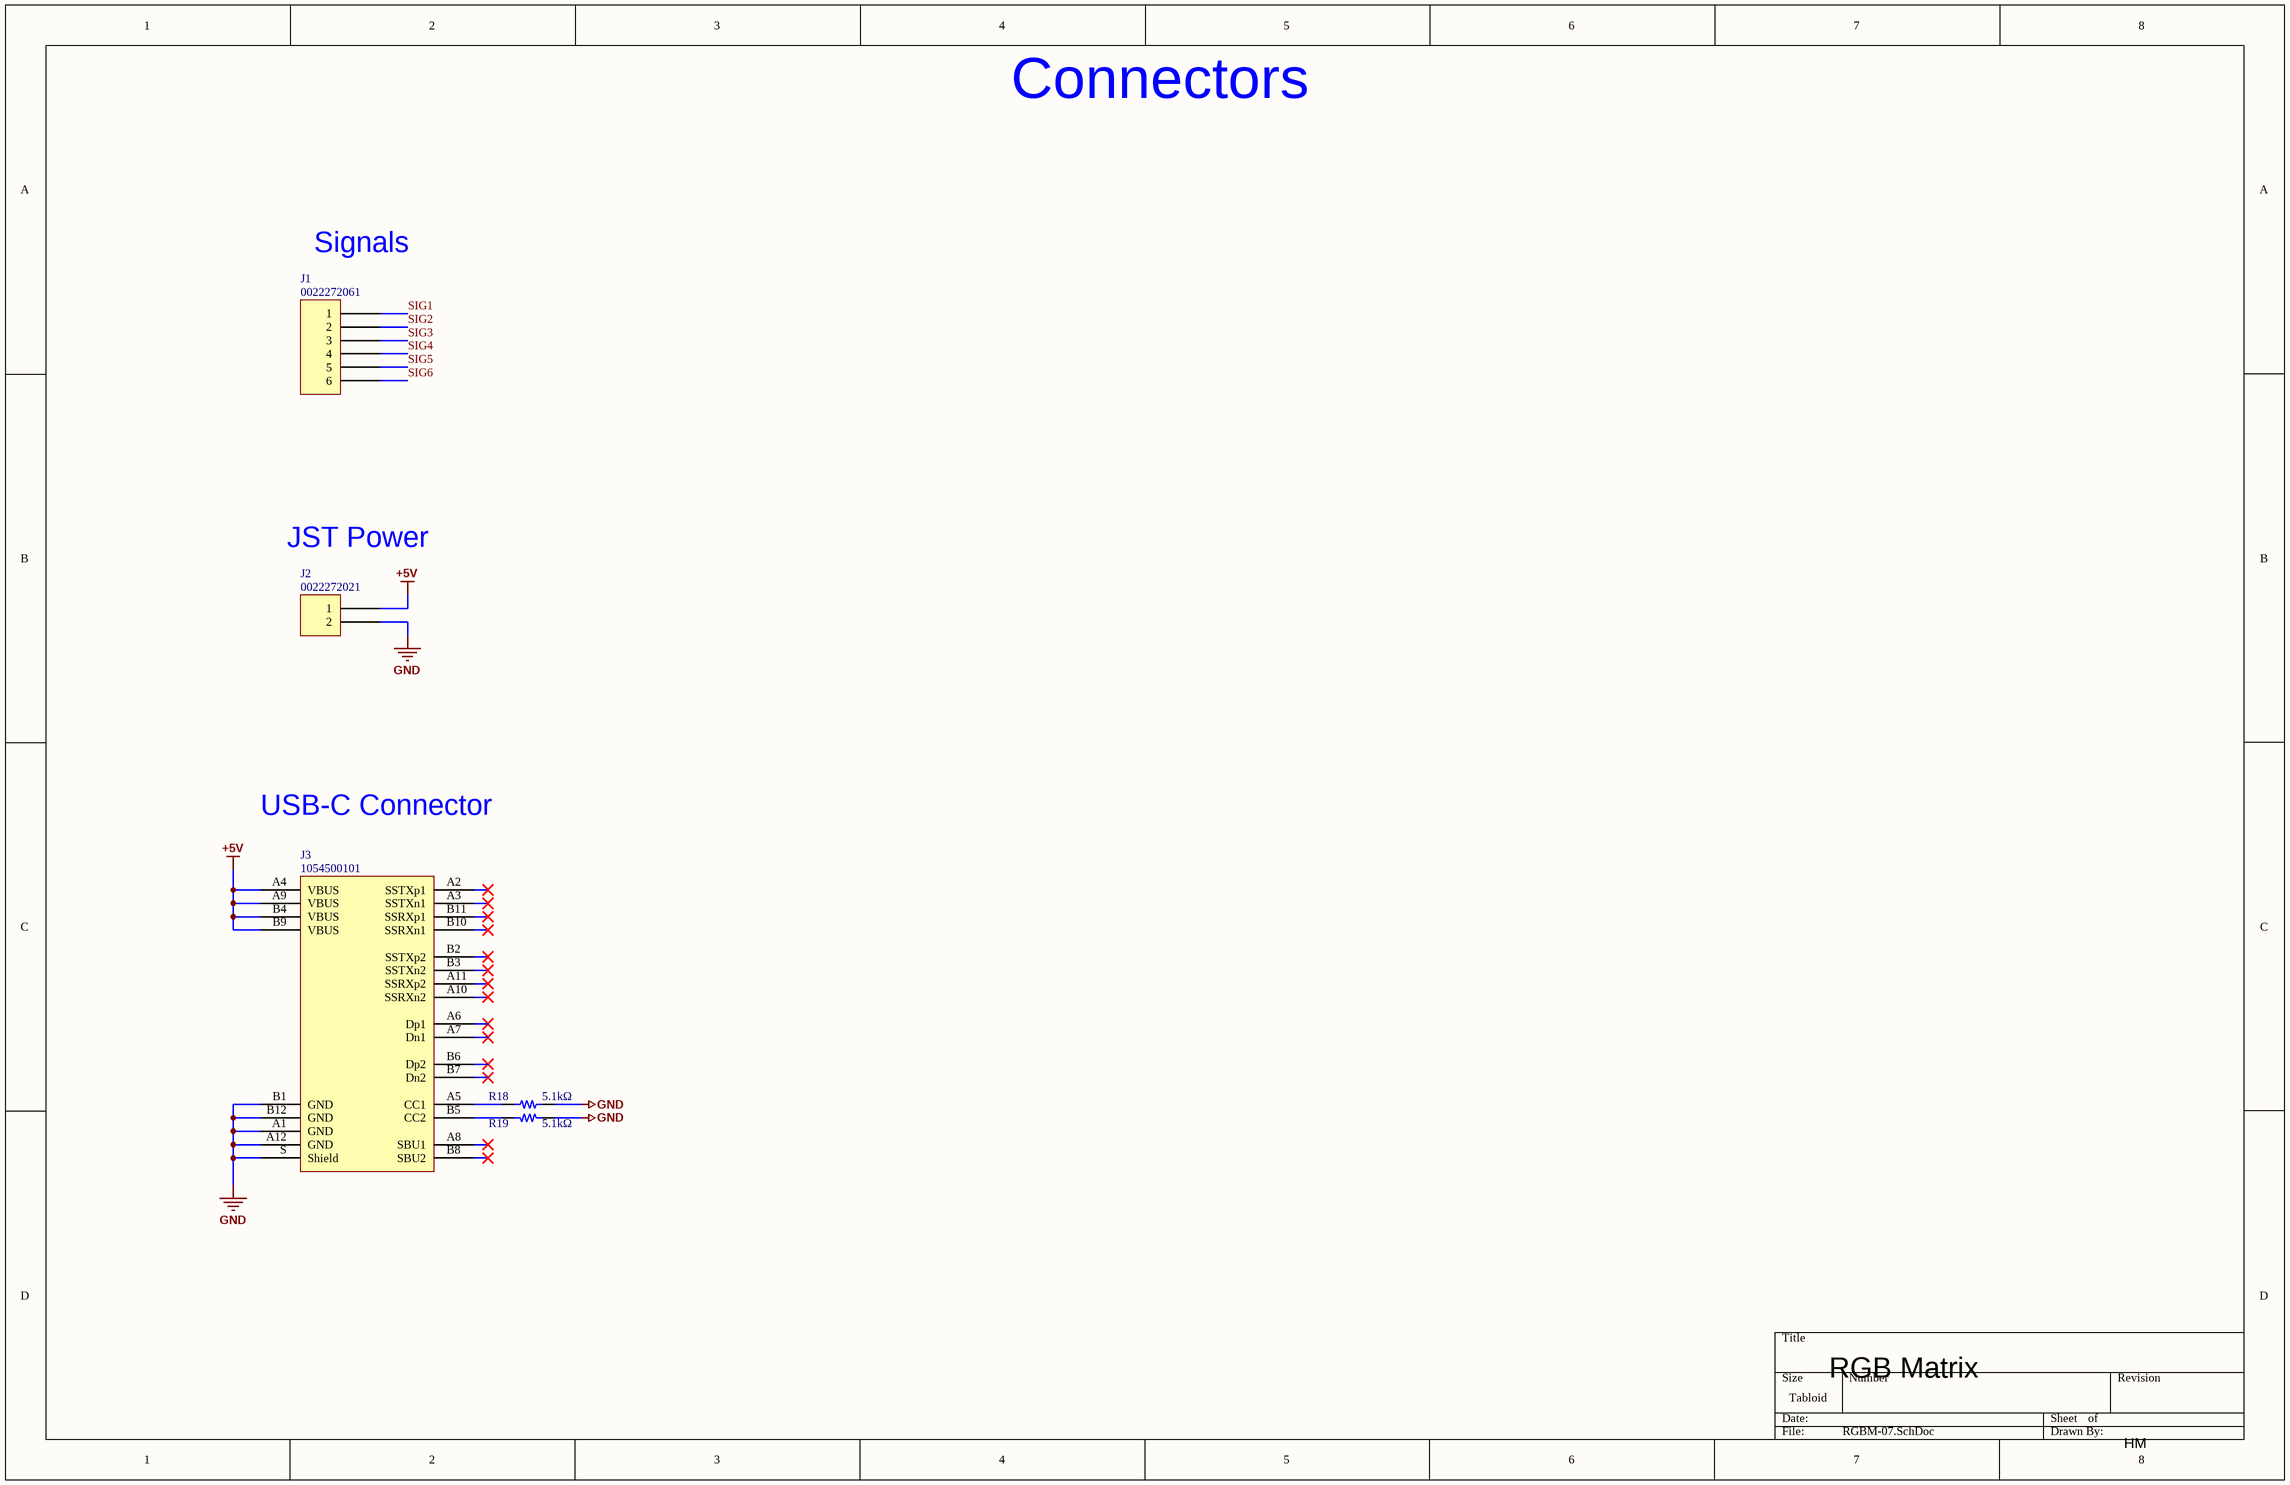
[diagram p6: RGBM-07.SchDoc]

### Parts
J1  0022272061  [MOLEX KK 0022272061]
J2  0022272021  [MOLEX KK 0022272021]
J3  1054500101  [Molex 1054500101]
R18  5.1kΩ  [RES 0603_1608]
R19  5.1kΩ  [RES 0603_1608]

### Nets
+5V: J2.1 J3.A4(VBUS) J3.A9(VBUS) J3.B4(VBUS) J3.B9(VBUS)
GND: J2.2 J3.A1(GND) J3.A12(GND) J3.B1(GND) J3.B12(GND) J3.S(Shield) R18.2 R19.2
SIG1: J1.1
SIG2: J1.2
SIG3: J1.3
SIG4: J1.4
SIG5: J1.5
SIG6: J1.6
NetJ3_A5: J3.A5(CC1) R18.1
NetJ3_B5: J3.B5(CC2) R19.1

Not connected (* = marked no-connect by the designer): J3 A2(SSTXp1)* A3(SSTXn1)* A6(Dp1)* A7(Dn1)* A8(SBU1)* A10(SSRXn2)* A11(SSRXp2)* B2(SSTXp2)* B3(SSTXn2)* B6(Dp2)* B7(Dn2)* B8(SBU2)* B10(SSRXn1)* B11(SSRXp1)*

### Notes on the sheet
- Connectors
- Signals
- JST Power
- USB-C Connector
- RGB Matrix
- HM

### Library data of the parts
J1 = 0022272061: CONN HEADER VERT 6POS 2.54MM; Manufacturer: Molex; Contact Length - Mating: 0.295" (7.49mm); Contact Length - Post: 0.140" (3.56mm); Material Flammability Rating: UL94 V-0; Number of Positions: 6; Number of Positions Loaded: All; Overall Contact Length: 0.560" (14.22mm); Pitch - Mating: 0.100" (2.54mm); Shrouding: Shrouded - 1 Wall; Style: Board to Cable/Wire; Part Number: 0022272061; ComponentLink1Description: Datasheet; ComponentLink1URL: https://www.molex.com/pdm_docs/sd/022272061_sd.pdf; ComponentLink2Description: DigiKey Link; ComponentLink2URL: http://digikey.com/product-detail/en/molex/0022272061/WM4115-ND/1130581; Connector Type: Header; Contact Finish - Mating: Tin; Contact Finish - Post: Tin; Contact Finish Thickness - Mating: 100.0µin (2.54µm); Contact Material: Brass; Contact Shape: Square; Contact Type: Male Pin; Fastening Type: Friction Lock; Insulation Color: Natural; Insulation Height: 0.461" (11.70mm); Insulation Material: Polyamide (PA), Nylon; LastUpdated: 2020-01-12 11:52:24 PM; Lifecycle Status: Active; Minimum Order: 1; Mounting Type: Through Hole; Number of Rows: 1; Packaging: Bulk; PartId: 80; Part Status: Active; Price: 0.49; Series: KK 6410; Supplier 1: DigiKey; Supplier Part Number 1: WM4115-ND; Termination: Solder
J2 = 0022272021: CONN HEADER VERT 2POS 2.54MM; Manufacturer: Molex; Contact Length - Mating: 0.295" (7.49mm); Contact Length - Post: 0.140" (3.56mm); Material Flammability Rating: UL94 V-0; Number of Positions: 2; Number of Positions Loaded: All; Overall Contact Length: 0.560" (14.22mm); Pitch - Mating: 0.100" (2.54mm); Shrouding: Shrouded - 1 Wall; Style: Board to Cable/Wire; Part Number: 0022272021; ComponentLink1Description: Datasheet; ComponentLink1URL: https://www.molex.com/pdm_docs/sd/022272021_sd.pdf; ComponentLink2Description: DigiKey Link; ComponentLink2URL: http://digikey.com/product-detail/en/molex/0022272021/WM4111-ND/1130577; Connector Type: Header; Contact Finish - Mating: Tin; Contact Finish - Post: Tin; Contact Finish Thickness - Mating: 100.0µin (2.54µm); Contact Material: Brass; Contact Shape: Square; Contact Type: Male Pin; Fastening Type: Friction Lock; Insulation Color: Natural; Insulation Height: 0.461" (11.70mm); Insulation Material: Polyamide (PA), Nylon; LastUpdated: 2020-01-12 11:51:43 PM; Lifecycle Status: Active; Minimum Order: 1; Mounting Type: Through Hole; Number of Rows: 1; Packaging: Bulk; PartId: 76; Part Status: Active; Price: 0.27; Series: KK 6410; Supplier 1: DigiKey; Supplier Part Number 1: WM4111-ND; Termination: Solder
J3 = 1054500101: CONN RCP USB3.1 TYPEC 24P SMD RA; Manufacturer: Molex; Connector Type: USB - C (Type - C); Current Rating (Amps): 0.25A, 1A, 5A; Gender: Receptacle; Mating Cycles: 10000; Number of Contacts: 24; Number of Ports: 1; Shielding: Shielded; Specifications: USB 3.1 (USB 3.1 Gen 2, Superspeed+); Voltage - Rated: 30VAC/DC; Part Number: 1054500101; ComponentLink1Description: Datasheet; ComponentLink1URL: https://www.molex.com/pdm_docs/ps/PS-105448-001.pdf; ComponentLink2Description: DigiKey Link; ComponentLink2URL: http://digikey.com/product-detail/en/molex/1054500101/WM12856CT-ND/5843891; LastUpdated: 2020-06-06 2:14:04 AM; Lifecycle Status: Active; Minimum Order: 1; Mounting Feature: Horizontal; Mounting Type: Surface Mount, Right Angle; Through Hole; Operating Temperature: -30°C ~ 85°C; Packaging: TapeAndReel; Part Status: Active; Price: 1.22; Series: 105445; Supplier 1: DigiKey; Supplier Part Number 1: WM12856CT-ND; Termination: Solder
R18 R19 = AC0603FR-075K1L: RES SMD 5.1K OHM 1% 1/10W 0603; Manufacturer: Yageo; Value: 5.1 kOhms; Power (Watts): 0.1W, 1/10W; Temperature Coefficient: ±100ppm/°C; Part Number: AC0603FR-075K1L; ComponentLink1Description: Datasheet; ComponentLink1URL: https://www.yageo.com/upload/media/product/productsearch/datasheet/rchip/PYu-AC_51_RoHS_L_7.pdf; ComponentLink2Description: DigiKey Link; ComponentLink2URL: https://www.digikey.com/en/products/detail/yageo/AC0603FR-075K1L/5896209; Composition: Thick Film; Device Package: 0603 (1608 Metric); Features: Automotive AEC-Q200, Moisture Resistant; Height - Seated (Max): 0.022" (0.55mm); LastUpdated: 2026-04-06 7:43:48 PM; Lifecycle Status: Active; Minimum Order: 1; Number of Terminations: 2; Operating Temperature: -55°C ~ 155°C; Package / Case: 0603 (1608 Metric); Packaging: CutTape; PartId: 17442; Part Status: Active; Price: 0.01; Ratings: AEC-Q200; Resistance: 5.1 kOhms; Series: AC; Size / Dimension: 0.063" L x 0.031" W (1.60mm x 0.80mm); Supplier 1: DigiKey; Supplier Part Number 1: YAG3621CT-ND; Supplier Device Package: 0603; Tolerance: ±1%

## Nets that join several sheets
+5V: RGBM-01 (96 pins), RGBM-02 (96 pins), RGBM-03 (96 pins), RGBM-04 (96 pins), RGBM-05 (96 pins), RGBM-06 (96 pins), RGBM-07 (5 pins)
GND: RGBM-01 (96 pins), RGBM-02 (96 pins), RGBM-03 (96 pins), RGBM-04 (96 pins), RGBM-05 (96 pins), RGBM-06 (96 pins), RGBM-07 (8 pins)
ROW_2_3: RGBM-01 (D48.2-DOUT), RGBM-02 (R3.2)
ROW_4_5: RGBM-02 (D96.2-DOUT), RGBM-03 (R6.2)
ROW_6_7: RGBM-03 (D144.2-DOUT), RGBM-04 (R9.2)
ROW_8_9: RGBM-04 (D192.2-DOUT), RGBM-05 (R12.2)
ROW_10_11: RGBM-05 (D240.2-DOUT), RGBM-06 (R15.2)
SIG1: RGBM-01 (R1.1), RGBM-07 (J1.1)
SIG2: RGBM-02 (R4.1), RGBM-07 (J1.2)
SIG3: RGBM-03 (R7.1), RGBM-07 (J1.3)
SIG4: RGBM-04 (R10.1), RGBM-07 (J1.4)
SIG5: RGBM-05 (R13.1), RGBM-07 (J1.5)
SIG6: RGBM-06 (R16.1), RGBM-07 (J1.6)